# Altium schematic sheet Output Driver.SchDoc
size A4
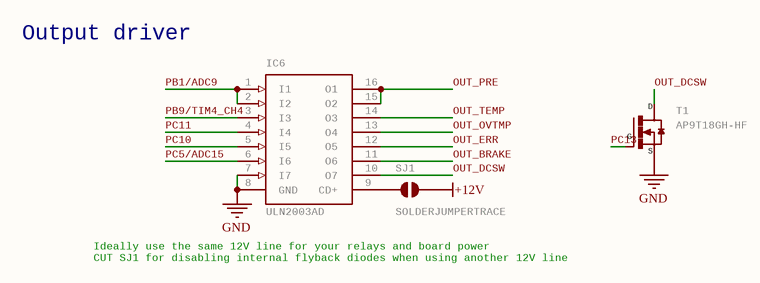
[diagram p0: Output Driver.SchDoc]

## Parts
IC6  ULN2003AD  [SO16]
SJ1  SOLDERJUMPERTRACE  [SJ_2S-TRACE]
T1  AP9T18GH-HF  [D-PAK_TO252AA]

## Nets
+12V: SJ1.2
GND: IC6.7(I7) IC6.8(GND) T1.3(S)
OUT_BRAKE: IC6.11(O6)
OUT_DCSW: IC6.10(O7) T1.4(D)
OUT_ERR: IC6.12(O5)
OUT_OVTMP: IC6.13(O4)
OUT_PRE: IC6.15(O2) IC6.16(O1)
OUT_TEMP: IC6.14(O3)
PB1/ADC9: IC6.1(I1) IC6.2(I2)
PB9/TIM4_CH4: IC6.3(I3)
PC5/ADC15: IC6.6(I6)
PC10: IC6.5(I5)
PC11: IC6.4(I4)
PC13: T1.1(G)
NetIC6_9: IC6.9(CD+) SJ1.1

## Notes on the sheet
- Output driver
- Ideally use the same 12V line for your relays and board power
  CUT SJ1 for disabling internal flyback diodes when using another 12V line

## Library data of the parts
IC6 = ULN2003AD: DRIVER ARRAY; GateName_1: A; SymbolName_1: 2001A; DeviceName: D; LibraryName: uln-udn; DeviceSetName: ULN2003A
SJ1 = SOLDERJUMPERTRACE: Solder JumperStandard SMD solder jumper. Used to automate production. Two varients : Normally Open and Normally Closed are the same, but have different paste layers. NC will have a large amount of paste and should jumper during reflow.; GateName_1: 1; SymbolName_1: SJ; DeviceName: TRACE; LibraryName: SparkFun-Passives; DeviceSetName: SOLDERJUMPER
T1 = AP9T18GH-HF: GateName_1: G$1; SymbolName_1: MOSFET_N; LibraryName: transistor-power; DeviceSetName: AP9T18GH-HF; D: D; S: S; G: G